# EAGLE design underdesk_macropad_pins (EAGLE 7.7.0)
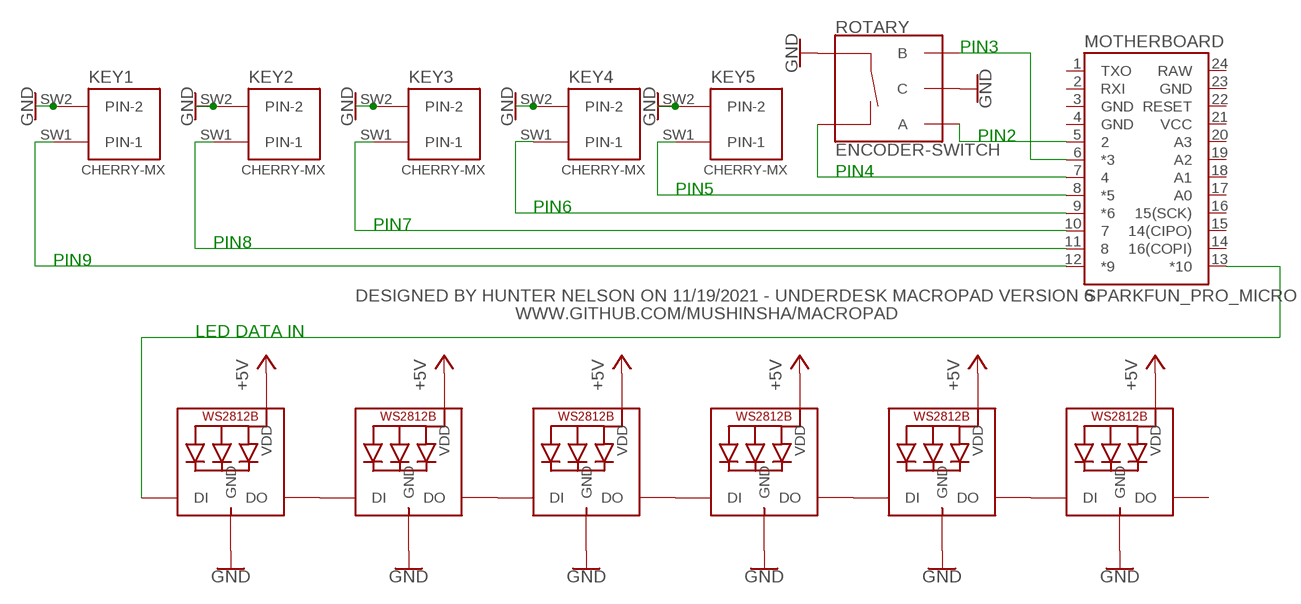
[diagram p0: schematic, sheet 1]

## Parts
KEY1  CHERRY-MX  [CHERRY-MX]
KEY2  CHERRY-MX  [CHERRY-MX]
KEY3  CHERRY-MX  [CHERRY-MX]
KEY4  CHERRY-MX  [CHERRY-MX]
KEY5  CHERRY-MX  [CHERRY-MX]
LED1  WS2812B5050  [WS2812B]
LED2  WS2812B5050  [WS2812B]
LED3  WS2812B5050  [WS2812B]
LED4  WS2812B5050  [WS2812B]
LED5  WS2812B5050  [WS2812B]
LED6  WS2812B5050  [WS2812B]
MOTHERBOARD  SPARKFUN_PRO_MICRO  [SPARKFUN_PRO_MICRO]
ROTARY  ENCODER-SWITCH  [ROTARY_ENC_PLAIN]

## Nets
+5V: LED1.1-VDD(VDD) LED2.1-VDD(VDD) LED3.1-VDD(VDD) LED4.1-VDD(VDD) LED5.1-VDD(VDD) LED6.1-VDD(VDD)
GND: KEY1.SW2(PIN-2) KEY2.SW2(PIN-2) KEY3.SW2(PIN-2) KEY4.SW2(PIN-2) KEY5.SW2(PIN-2) LED1.3-GND(GND) LED2.3-GND(GND) LED3.3-GND(GND) LED4.3-GND(GND) LED5.3-GND(GND) LED6.3-GND(GND) ROTARY.C ROTARY.SW+
N$1: LED1.2-DOUT(DO) LED2.4-DIN(DI)
N$2: LED2.2-DOUT(DO) LED3.4-DIN(DI)
N$3: LED3.2-DOUT(DO) LED4.4-DIN(DI)
N$4: LED4.2-DOUT(DO) LED5.4-DIN(DI)
N$5: MOTHERBOARD.5 ROTARY.A
N$6: LED1.4-DIN(DI) MOTHERBOARD.13(*10)
N$7: MOTHERBOARD.6(*3) ROTARY.B
N$11: MOTHERBOARD.7 ROTARY.SW-
N$12: KEY5.SW1(PIN-1) MOTHERBOARD.8(*5)
N$13: KEY4.SW1(PIN-1) MOTHERBOARD.9(*6)
N$14: KEY3.SW1(PIN-1) MOTHERBOARD.10
N$15: KEY2.SW1(PIN-1) MOTHERBOARD.11
N$16: KEY1.SW1(PIN-1) MOTHERBOARD.12(*9)
N$18: LED5.2-DOUT(DO) LED6.4-DIN(DI)
Unconnected: LED6.2-DOUT(DO) MOTHERBOARD.1(TXO) MOTHERBOARD.2(RXI) MOTHERBOARD.14(16(COPI)) MOTHERBOARD.15(14(CIPO)) MOTHERBOARD.16(15(SCK)) MOTHERBOARD.17(A0) MOTHERBOARD.18(A1) MOTHERBOARD.19(A2) MOTHERBOARD.20(A3) MOTHERBOARD.22(RESET)

## Notes on the sheet
- PIN3
- PIN2
- PIN4
- PIN5
- PIN6
- PIN7
- PIN8
- PIN9
- DESIGNED BY HUNTER NELSON ON 11/19/2021 - UNDERDESK MACROPAD VERSION 6
- WWW.GITHUB.COM/MUSHINSHA/MACROPAD
- LED DATA IN

## Power pins joined to a net without a drawn wire
GND: MOTHERBOARD.3(GND) MOTHERBOARD.4(GND) MOTHERBOARD.23(GND)
RAW: MOTHERBOARD.24(RAW)
VCC: MOTHERBOARD.21(VCC)

## Library data of the parts
KEY1-KEY5 = cherrymx:CHERRY-MX: Cherry MX series keyswitch
LED1-LED6 = adafruit:WS2812B
MOTHERBOARD = SparkFun-Boards:SPARKFUN_PRO_MICRO: SparkFun Pro Micro Atmega32U4 compatible footprint. SparkFun Products: 3.3V/8MHz <https://www.sparkfun.com/products/12587> 5V/16MHz <https://www.sparkfun.com/products/12640>
ROTARY = SparkFun-Switches:ENCODER-SWITCH: Rotary Encoder w/ Select Switch Encoders rotate similarly to potentiometers, but they’re different from potentiometers in that an encoder has full rotation without limits. They output gray code so that you can tell how much and in which direction the encoder has been turned. This encoder includes a push-down select switch built into the shaft. SparkFun Products Rotary Encoder <https://www.sparkfun.com/products/9117> (COM-09117); SF_SKU: COM-09117

## Board
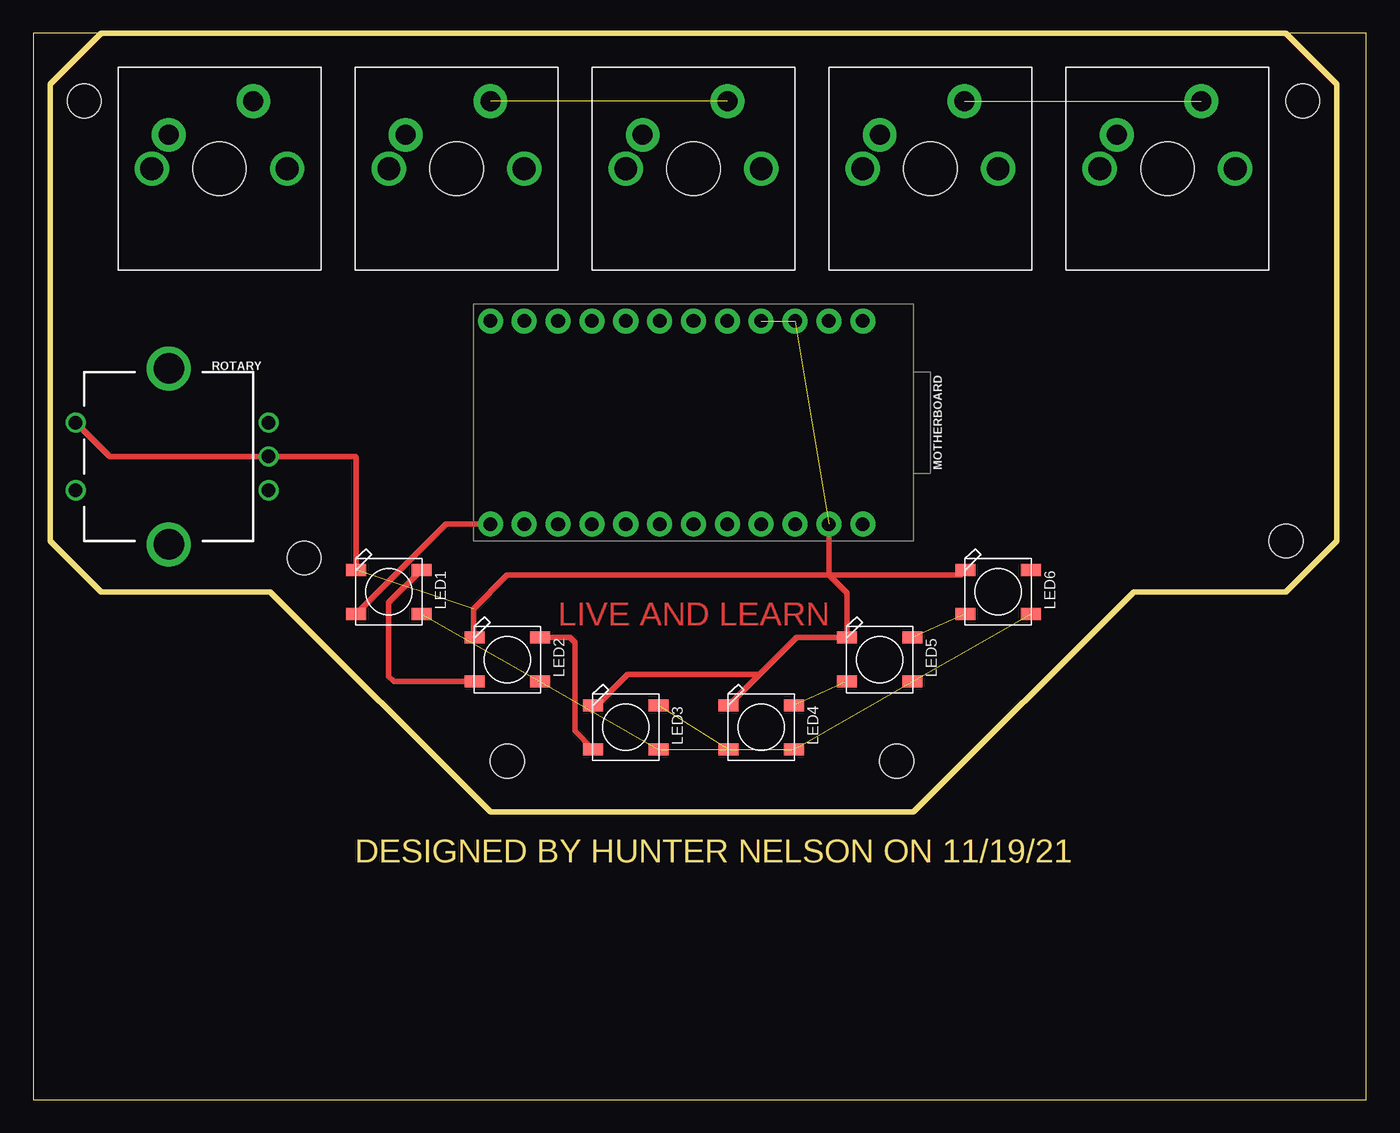
[diagram p1: board, top side]
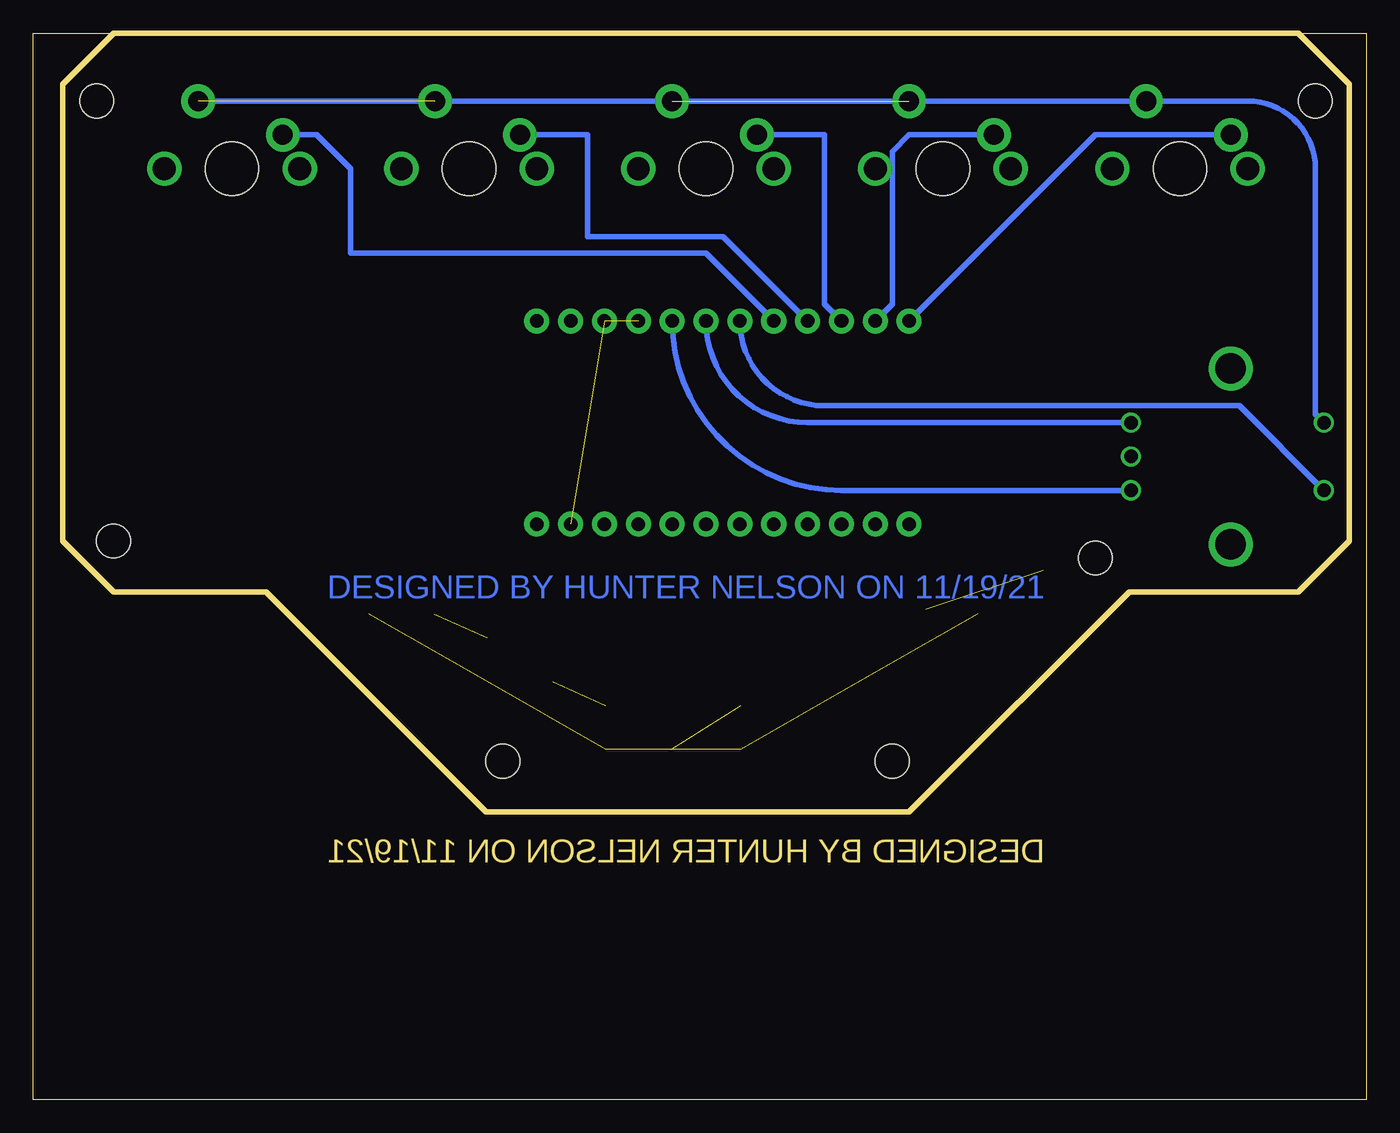
[diagram p2: board, bottom side, seen from below]

Size 100 x 80.01 mm. Coordinates in mm from the lower left corner, seen from the top.
Outline: 0,0 100,0 100,80 0,80 0,0
Outline: 1.27,76.2 1.27,41.91 5.08,38.1 17.78,38.1 34.29,21.59 66.04,21.59 82.55,38.1 93.98,38.1 97.79,41.91 97.79,76.2 93.98,80.01 5.08,80.01 1.27,76.2
Copper layers (1*16): Top 0.035mm / dielectric 1.5mm / Bottom 0.035mm
Design rules "default": minimum track width 10mil, minimum drill 24mil, track to track 8mil, track to pad 8mil, pad to pad 8mil, via to via 8mil, smd to smd 8mil, copper to edge 40mil, drill to drill 8mil, minimum pad ring 10mil, minimum via ring 8mil, stop-mask expansion 4mil, vias tented up to drill 0mil, thermal gap 10mil
Holes 2.54 mm at 95.25,74.93 3.81,74.93 93.98,41.91 20.32,40.64 64.77,25.4 35.56,25.4

### Footprints (pad centres in the part's own frame; a part is rotated, then mirrored left to right if it is on the bottom)
CHERRY-MX = drill 1.714 pad 1.93: P$3 -5.08,0; P$4 5.08,0 | drill 1.5 pad 2.54: SW1 -3.81,2.54; SW2 2.54,5.08 | hole 4: 0,0
WS2812B = smd 1.5 x 0.9: 1-VDD 2.45,-1.65; 2-DOUT 2.45,1.65; 3-GND -2.45,1.65; 4-DIN -2.45,-1.65
SPARKFUN_PRO_MICRO = drill 1.016 pad 1.88: 1 -7.62,12.7; 2 -7.62,10.16; 3 -7.62,7.62; 4 -7.62,5.08; 5 -7.62,2.54; 6 -7.62,0; 7 -7.62,-2.54; 8 -7.62,-5.08; 9 -7.62,-7.62; 10 -7.62,-10.16; 11 -7.62,-12.7; 12 -7.62,-15.24; 13 7.62,-15.24; 14 7.62,-12.7; 15 7.62,-10.16; 16 7.62,-7.62; 17 7.62,-5.08; 18 7.62,-2.54; 19 7.62,0; 20 7.62,2.54; 21 7.62,5.08; 22 7.62,7.62; 23 7.62,10.16; 24 7.62,12.7
ROTARY_ENC_PLAIN = drill 1.016: A 7.493,-2.54; B 7.493,2.54; C 7.493,0; SW+ -6.985,2.54; SW- -6.985,-2.54 | drill 2.286: P$3 0,6.604; P$4 0,-6.604

### Placement (x,y rotation side)
KEY1  13.97,69.85 0 top
KEY2  31.75,69.85 0 top
KEY3  49.53,69.85 0 top
KEY4  67.31,69.85 0 top
KEY5  85.09,69.85 0 top
LED1  26.67,38.1 0 top
LED2  35.56,33.02 0 top
LED3  44.45,27.94 0 top
LED4  54.61,27.94 0 top
LED5  63.5,33.02 0 top
LED6  72.39,38.1 0 top
MOTHERBOARD  49.53,50.8 270 top
ROTARY  10.16,48.26 0 top

### Tracks (layer width: path | path; a pad name or v marks a point on that pad's centre or on a via)
+5V  (5 unrouted)
GND  (5 unrouted)
  Top 0.406: LED6.3-GND 69.56,39.37 59.69,39.37 | 59.69,39.37 61.05,38.01 LED5.3-GND 57.24,34.67 54.47,31.89 | MOTHERBOARD.23 59.69,39.37 | LED4.3-GND 54.47,31.89 | LED1.3-GND 24.22,48.17 24.13,48.26 ROTARY.C 5.71,48.26 ROTARY.SW+ | LED2.3-GND 33.02,34.76 33.02,36.83 35.56,39.37 59.69,39.37 | LED3.3-GND 41.91,29.5 41.91,29.21 44.59,31.89 54.47,31.89
  Bottom 0.406: ROTARY.SW+ 3.81,51.44 3.81,69.85 arc-90 8.89,74.93 KEY5.SW2 KEY2.SW2 KEY1.SW2
N$1
  Top 0.406: LED1.2-DOUT 26.67,37.3 26.67,31.75 27.05,31.37 LED2.4-DIN
N$2
  Top 0.406: LED3.4-DIN 40.64,27.65 40.64,34.29 40.26,34.67 LED2.2-DOUT
N$3  (1 unrouted)
N$4  (1 unrouted)
N$5
  Bottom 0.406: ROTARY.A 39.37,45.72 arc90 MOTHERBOARD.5
N$6
  Top 0.406: LED1.4-DIN 30.95,43.18 MOTHERBOARD.13
N$7
  Bottom 0.406: ROTARY.B 41.91,50.8 arc90 MOTHERBOARD.6
N$11
  Bottom 0.406: ROTARY.SW- 9.53,52.07 40.64,52.07 arc90 MOTHERBOARD.7
N$12
  Bottom 0.406: KEY5.SW1 78.74,72.39 76.2,69.85 76.2,63.5 49.53,63.5 MOTHERBOARD.8
N$13
  Bottom 0.406: KEY4.SW1 58.42,72.39 58.42,64.77 48.26,64.77 MOTHERBOARD.9
N$14
  Bottom 0.406: KEY3.SW1 40.64,72.39 40.64,59.69 MOTHERBOARD.10
N$15
  Bottom 0.406: KEY2.SW1 34.29,72.39 35.56,71.12 35.56,59.69 MOTHERBOARD.11
N$16
  Bottom 0.406: KEY1.SW1 20.32,72.39 MOTHERBOARD.12
N$18  (1 unrouted)

### Text on the board
Top: LIVE AND LEARN
Bottom: DESIGNED BY HUNTER NELSON ON 11/19/21
Dimension: DESIGNED BY HUNTER NELSON ON 11/19/21